# EAGLE design F3-Octo-Brushed-SIDE-USB-JMPR (EAGLE 7.5.0)
Title: F3 Octo Brushed - Side USB Author: Lance Source: Alienflight.com License: CC BY SA <http://creativecommons.org/licenses/by-sa/4.0/>
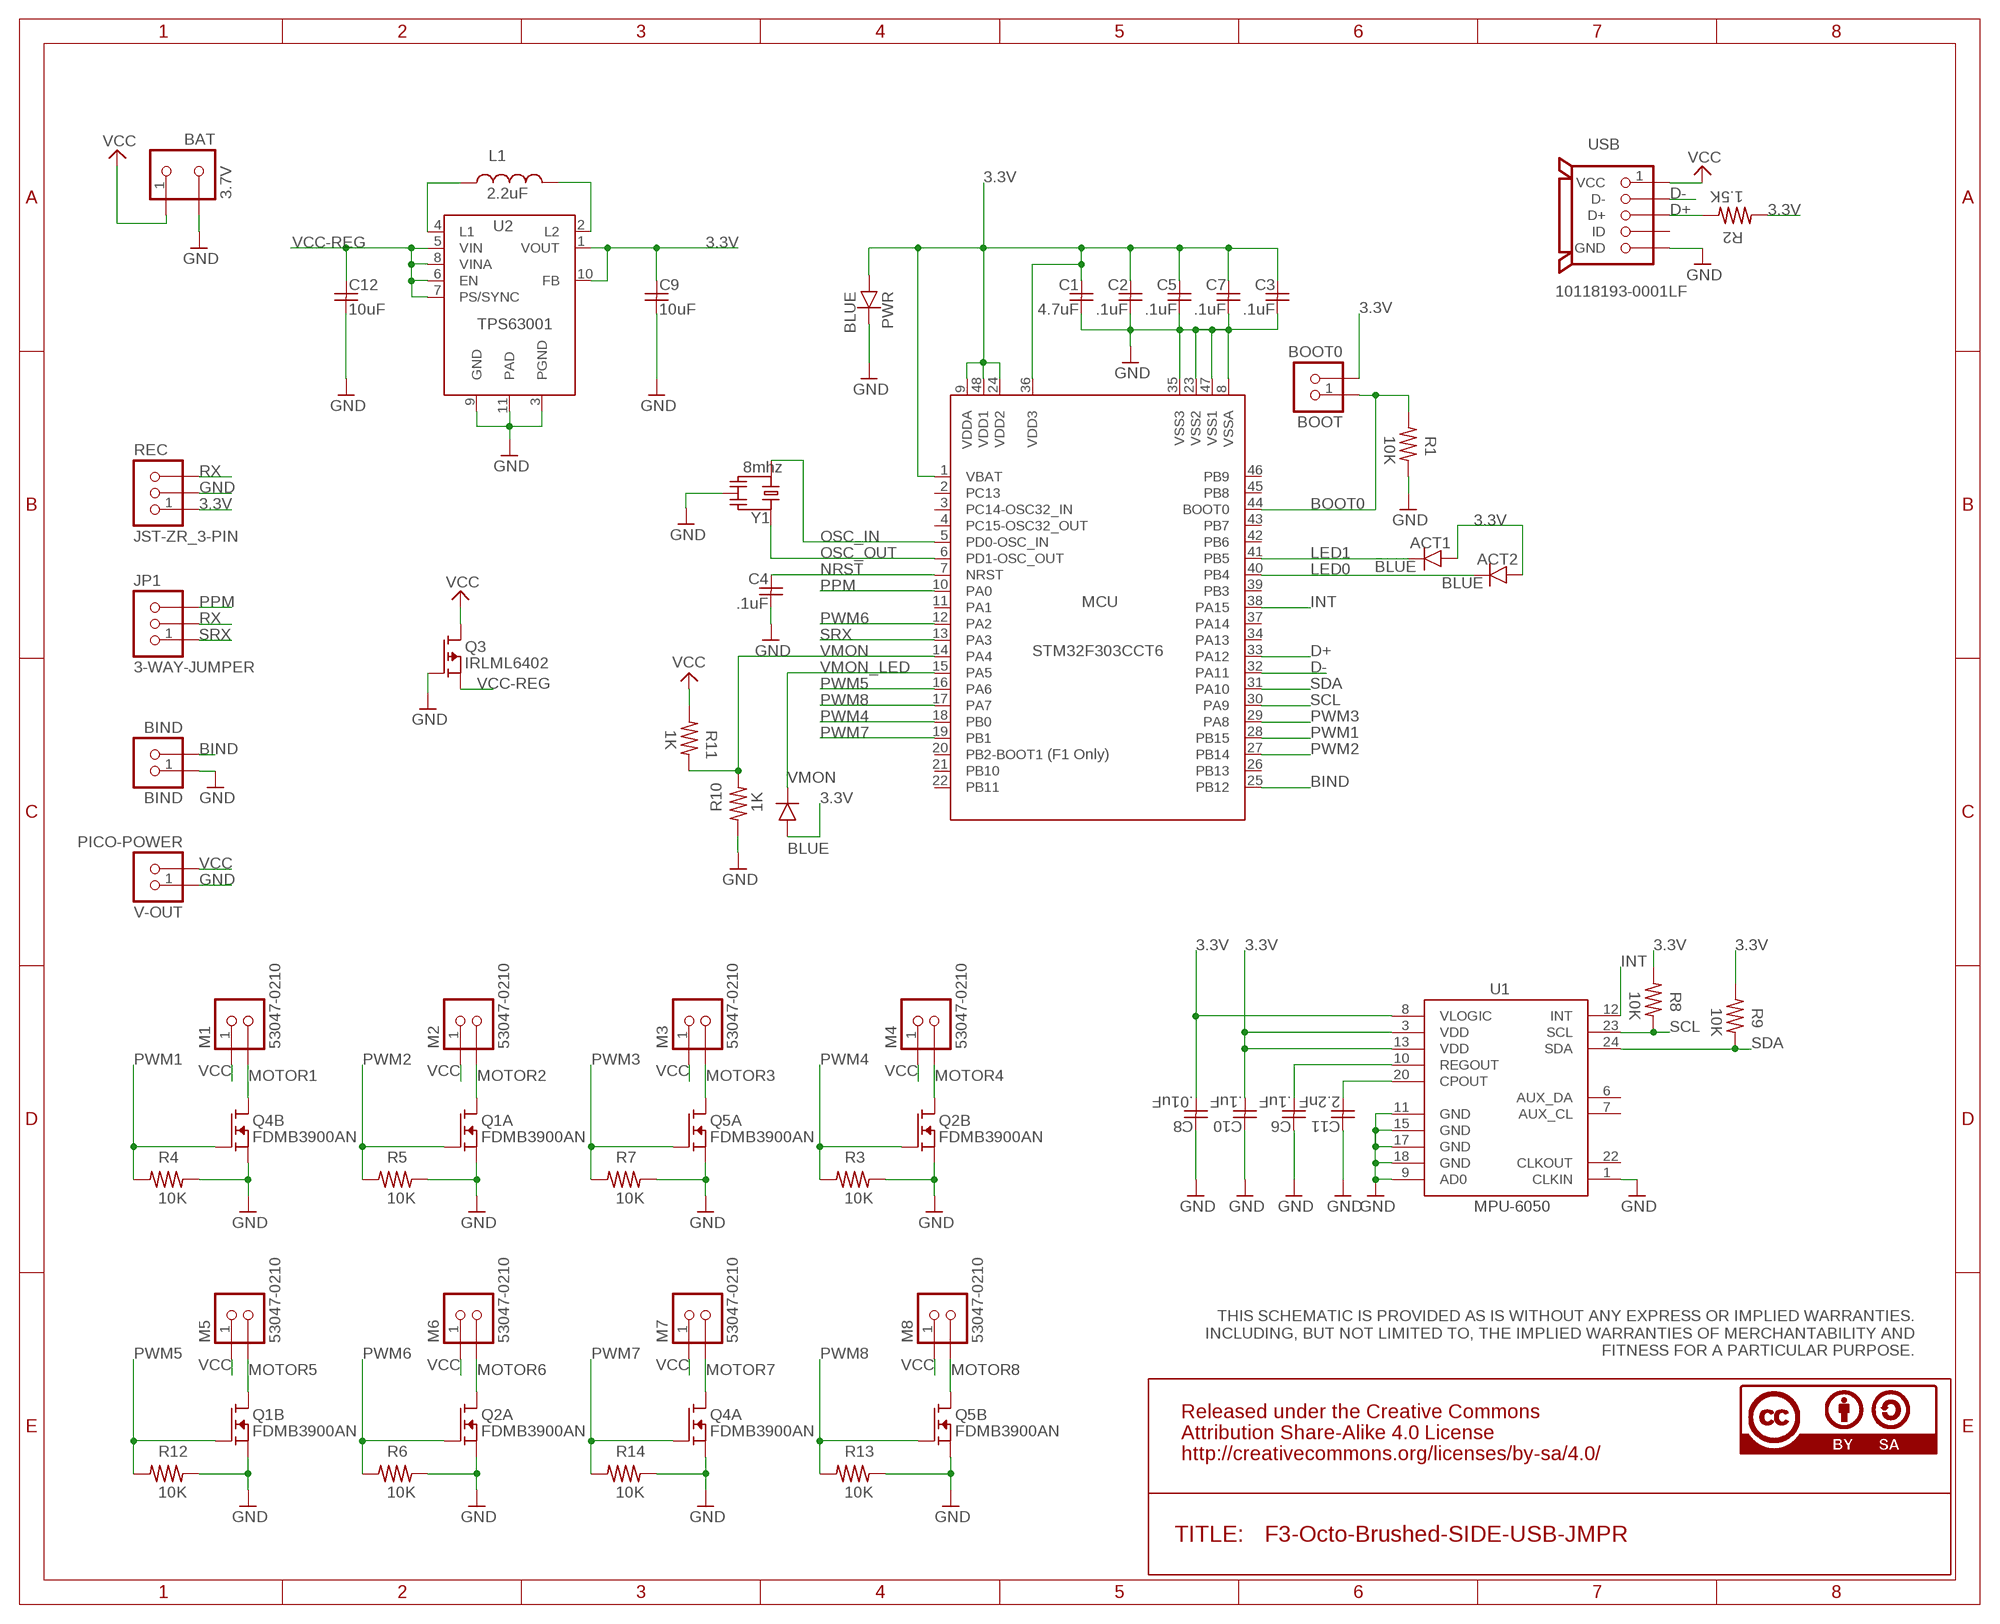
[diagram p0: schematic, sheet 1]

## Parts
ACT1  BLUE  SMD-CHIP-LED-0805  [SMD-CHIP-LED-0805]
ACT2  BLUE  SMD-CHIP-LED-0805  [SMD-CHIP-LED-0805]
BAT  3.7V  JST-PH-BAT  [S2B-PH-K-S]
BIND  BIND  1.27MM-PINHEADX2  [1.27MM-PINHEADX2]
BOOT  BOOT0  1.27MM-PINHEADX2  [1.27MM-PINHEADX2]
C1  4.7uF  CAPACITOR4.7UF  [MUR-CAP-0603]
C2  .1uF  CAPACITOR.1UF  [MUR-CAP-0603]
C3  .1uF  CAPACITOR.1UF  [MUR-CAP-0603]
C4  .1uF  CAPACITOR.1UF  [MUR-CAP-0603]
C5  .1uF  CAPACITOR.1UF  [MUR-CAP-0603]
C6  .1uF  CAPACITOR.1UF  [MUR-CAP-0603]
C7  .1uF  CAPACITOR.1UF  [MUR-CAP-0603]
C8  .01uF  CAPACITOR.01UF  [MUR-CAP-0603]
C9  10uF  CAPACITOR10UF  [YUDEN-CAP-0805]
C10  .1uF  CAPACITOR.1UF  [MUR-CAP-0603]
C11  2.2nF  CAPACITOR2.2NF  [MUR-CAP-0603]
C12  10uF  CAPACITOR10UF  [YUDEN-CAP-0805]
JP1  3-WAY-JUMPER  [3-WAY-JUMPER]
L1  2.2uF  NR301X  [NR301X]
M1  53047-0210  PICO-1.25-MOTOR  [PICO-53047-02]
M2  53047-0210  PICO-1.25-MOTOR  [PICO-53047-02]
M3  53047-0210  PICO-1.25-MOTOR  [PICO-53047-02]
M4  53047-0210  PICO-1.25-MOTOR  [PICO-53047-02]
M5  53047-0210  PICO-1.25-MOTOR  [PICO-53047-02]
M6  53047-0210  PICO-1.25-MOTOR  [PICO-53047-02]
M7  53047-0210  PICO-1.25-MOTOR  [PICO-53047-02]
M8  53047-0210  PICO-1.25-MOTOR  [PICO-53047-02]
MCU  STM32F303CCT6  STM32FX03-F3  [LQFP48-7X7]
PWR  BLUE  SMD-CHIP-LED-0805  [SMD-CHIP-LED-0805]
Q1  FDMB3900AN  [8-WDFN-DUAL]
Q2  FDMB3900AN  [8-WDFN-DUAL]
Q3  IRLML6402  [SOT-23]
Q4  FDMB3900AN  [8-WDFN-DUAL]
Q5  FDMB3900AN  [8-WDFN-DUAL]
R1  10K  RESISTOR10K  [VISH-RES-0603]
R2  1.5K  RESISTOR1.5K  [VISH-RES-0603]
R3  10K  RESISTOR10K  [VISH-RES-0603]
R4  10K  RESISTOR10K  [VISH-RES-0603]
R5  10K  RESISTOR10K  [VISH-RES-0603]
R6  10K  RESISTOR10K  [VISH-RES-0603]
R7  10K  RESISTOR10K  [VISH-RES-0603]
R8  10K  RESISTOR10K  [VISH-RES-0603]
R9  10K  RESISTOR10K  [VISH-RES-0603]
R10  1K  RESISTOR1K  [VISH-RES-0603]
R11  1K  RESISTOR1K  [VISH-RES-0603]
R12  10K  RESISTOR10K  [VISH-RES-0603]
R13  10K  RESISTOR10K  [VISH-RES-0603]
R14  10K  RESISTOR10K  [VISH-RES-0603]
REC  JST-ZR_3-PIN  [S3B-ZR]
U1  MPU-6050  [QFN24-4X4]
U2  TPS63001  TPS630XX-TPS63001  [VSON-N10]
USB  10118193-0001LF  USB-MICRO-B-FCI  [10118193-0001LF]
V-OUT  PICO-POWER  [PICO_1.25_.5MM]
VMON  BLUE  SMD-CHIP-LED-0805  [SMD-CHIP-LED-0805]
Y1  8mhz  RESONATOR8MHZ  [RESONATOR_8]

## Nets
3.3V: ACT1.A ACT2.A BOOT.2 C1.1 C2.1 C3.1 C5.1 C7.1 C8.2 C9.1 C10.2 MCU.1(VBAT) MCU.9(VDDA) MCU.24(VDD2) MCU.36(VDD3) MCU.48(VDD1) PWR.A R2.2 R8.2 R9.2 REC.1 U1.3(VDD) U1.8(VLOGIC) U1.13(VDD) U2.1(VOUT) U2.10(FB) VMON.A
BIND: BIND.2 MCU.25(PB12)
BOOT0: BOOT.1 MCU.44(BOOT0) R1.2
D+: MCU.33(PA12) R2.1 USB.3(D+)
D-: MCU.32(PA11) USB.2(D-)
GND: BAT.2 BIND.1 C1.2 C2.2 C3.2 C4.2 C5.2 C6.1 C7.2 C8.1 C9.2 C10.1 C11.1 C12.2 MCU.8(VSSA) MCU.23(VSS2) MCU.35(VSS3) MCU.47(VSS1) PWR.C Q1.1@S1(A:S) Q1.3@S1(B:S) Q2.1@S1(A:S) Q2.3@S1(B:S) Q3.1(G) Q4.1@S1(A:S) Q4.3@S1(B:S) Q5.1@S1(A:S) Q5.3@S1(B:S) R1.1 R3.1 R4.1 R5.1 R6.1 R7.1 R10.2 R12.1 R13.1 R14.1 REC.2 U1.1(CLKIN) U1.9(AD0) U1.11(GND) U1.15(GND) U1.17(GND) U1.18(GND) U2.3(PGND) U2.9(GND) U2.11(PAD) USB.5(GND) USB.GND USB.GND2(GND) USB.HOLE1(GND) USB.HOLE2(GND) V-OUT.1 Y1.2
INT: MCU.38(PA15) U1.12(INT)
LED0: ACT2.C MCU.40(PB4)
LED1: ACT1.C MCU.41(PB5)
MOTOR1: M1.2 Q4.5+6(B:D)
MOTOR2: M2.2 Q1.7+8(A:D)
MOTOR3: M3.2 Q5.7+8(A:D)
MOTOR4: M4.2 Q2.5+6(B:D)
MOTOR5: M5.2 Q1.5+6(B:D)
MOTOR6: M6.2 Q2.7+8(A:D)
MOTOR7: M7.2 Q4.7+8(A:D)
MOTOR8: M8.2 Q5.5+6(B:D)
N$1: C6.2 U1.10(REGOUT)
N$7: C11.2 U1.20(CPOUT)
N$8: L1.2 U2.2(L2)
N$9: L1.1 U2.4(L1)
NRST: C4.1 MCU.7(NRST)
OSC_IN: MCU.5(PD0-OSC_IN) Y1.3
OSC_OUT: MCU.6(PD1-OSC_OUT) Y1.1
PPM: JP1.3 MCU.10(PA0)
PWM1: MCU.28(PB15) Q4.4@G2(B:G) R4.2
PWM2: MCU.27(PB14) Q1.2@G1(A:G) R5.2
PWM3: MCU.29(PA8) Q5.2@G1(A:G) R7.2
PWM4: MCU.18(PB0) Q2.4@G2(B:G) R3.2
PWM5: MCU.16(PA6) Q1.4@G2(B:G) R12.2
PWM6: MCU.12(PA2) Q2.2@G1(A:G) R6.2
PWM7: MCU.19(PB1) Q4.2@G1(A:G) R14.2
PWM8: MCU.17(PA7) Q5.4@G2(B:G) R13.2
RX: JP1.2 REC.3
SCL: MCU.30(PA9) R8.1 U1.23(SCL)
SDA: MCU.31(PA10) R9.1 U1.24(SDA)
SRX: JP1.1 MCU.13(PA3)
VCC [vcc]: BAT.1 M1.1 M2.1 M3.1 M4.1 M5.1 M6.1 M7.1 M8.1 Q3.3(D) R11.2 USB.1(VCC) V-OUT.2
VCC-REG [vcc]: C12.1 Q3.2(S) U2.5(VIN) U2.6(EN) U2.7(PS/SYNC) U2.8(VINA)
VMON: MCU.14(PA4) R10.1 R11.1
VMON_LED: MCU.15(PA5) VMON.C
Unconnected: MCU.2(PC13) MCU.3(PC14-OSC32_IN) MCU.4(PC15-OSC32_OUT) MCU.11(PA1) MCU.20(PB2-BOOT1) MCU.21(PB10) MCU.22(PB11) MCU.26(PB13) MCU.34(PA13) MCU.37(PA14) MCU.39(PB3) MCU.42(PB6) MCU.43(PB7) MCU.45(PB8) MCU.46(PB9) U1.6(AUX_DA) U1.7(AUX_CL) U1.22(CLKOUT) USB.4(ID)

## Notes on the sheet
- THIS SCHEMATIC IS PROVIDED AS IS WITHOUT ANY EXPRESS OR IMPLIED WARRANTIES.
   INCLUDING, BUT NOT LIMITED TO, THE IMPLIED WARRANTIES OF MERCHANTABILITY AND
   FITNESS FOR A PARTICULAR PURPOSE.

## Library data of the parts
ACT1 ACT2 PWR VMON = Alienflight:SMD-CHIP-LED-0805: SMD CHIP LED APHCM2012QBC/D-F01 View Datasheet <https://www.kingbrightusa.com/images/catalog/spec/APHCM2012QBC-D-F01.pdf> Author: Lance Source: http://alienflight.com License: CC BY SA <creativecommons.org/licenses/by-sa/4.0/>; MF: Kingbright; MPN: APHCM2012QBC/D-F01
BAT = Alienflight:JST-PH-BAT: Battery Connector JST- S2B-PH-K-S View Datasheet <http://www.jst-mfg.com/product/pdf/eng/ePH.pdf> Author: Lance Source: http://alienflight.com License: CC BY SA <creativecommons.org/licenses/by-sa/4.0/>; MF: JST; MPN: S2B-PH-K-S
BIND BOOT = Alienflight:1.27MM-PINHEADX2: Jumper 1.27MM Pin Header X2 View Datasheet <http://www.sullinscorp.com/catalogs/82_PAGE90-91_.050_MALE_HDR_ST_RA_SMT.pdf> Author: Lance Source: http://alienflight.com License: CC BY SA <creativecommons.org/licenses/by-sa/4.0/>; MF: Sullins; MPN: GRPB021VWVN-RC (JUMPER IS M50-1930005)
C1 = Alienflight:CAPACITOR: CAPACITORS Murata Datasheet <http://www.murata.com/~/media/webrenewal/support/library/catalog/products/capacitor/mlcc/c02e.ashx?la=en-us> Taiyo Yuden Datasheet <http://www.mouser.com/ds/2/396/mlcc11_hq_e-541564.pdf> Author: Lance Source: http://alienflight.com License: CC BY SA <creativecommons.org/licenses/by-sa/4.0/>; MF: Murata; MPN: GRJ188C70J475KE11D
C2-C7 C10 = Alienflight:CAPACITOR: CAPACITORS Murata Datasheet <http://www.murata.com/~/media/webrenewal/support/library/catalog/products/capacitor/mlcc/c02e.ashx?la=en-us> Taiyo Yuden Datasheet <http://www.mouser.com/ds/2/396/mlcc11_hq_e-541564.pdf> Author: Lance Source: http://alienflight.com License: CC BY SA <creativecommons.org/licenses/by-sa/4.0/>; MF: Murata; MPN: GRM188R71C104KA01D
C8 = Alienflight:CAPACITOR: CAPACITORS Murata Datasheet <http://www.murata.com/~/media/webrenewal/support/library/catalog/products/capacitor/mlcc/c02e.ashx?la=en-us> Taiyo Yuden Datasheet <http://www.mouser.com/ds/2/396/mlcc11_hq_e-541564.pdf> Author: Lance Source: http://alienflight.com License: CC BY SA <creativecommons.org/licenses/by-sa/4.0/>; MF: Murata; MPN: GRM188R71C103KA01D
C9 C12 = Alienflight:CAPACITOR: CAPACITORS Murata Datasheet <http://www.murata.com/~/media/webrenewal/support/library/catalog/products/capacitor/mlcc/c02e.ashx?la=en-us> Taiyo Yuden Datasheet <http://www.mouser.com/ds/2/396/mlcc11_hq_e-541564.pdf> Author: Lance Source: http://alienflight.com License: CC BY SA <creativecommons.org/licenses/by-sa/4.0/>; MF: Taiyo Yuden; MPN: JMK212AB7106KG-T
C11 = Alienflight:CAPACITOR: CAPACITORS Murata Datasheet <http://www.murata.com/~/media/webrenewal/support/library/catalog/products/capacitor/mlcc/c02e.ashx?la=en-us> Taiyo Yuden Datasheet <http://www.mouser.com/ds/2/396/mlcc11_hq_e-541564.pdf> Author: Lance Source: http://alienflight.com License: CC BY SA <creativecommons.org/licenses/by-sa/4.0/>; MF: Murata; MPN: GRM188R71C222KA01D
JP1 = Alienflight:3-WAY-JUMPER: 3 Way Jumper
L1 = Alienflight:NR301X: 3X3mm Inductor NR3015T2R2M - Datasheet <http://datasheet.octopart.com/NR3015T2R2M-Taiyo-Yuden-datasheet-41181804.pdf> Author: Lance Source: http://alienflight.com License: CC BY SA <creativecommons.org/licenses/by-sa/4.0/>; MF: Taiyo Yuden; MPN: NR3015T2R2M
M1-M8 = Alienflight:PICO-1.25-MOTOR: Motor Connector PicoBlade 1.25 53047-02 View Datasheet <http://www.molex.com/webdocs/datasheets/pdf/en-us/0530470210_PCB_HEADERS.pdf> Author: Lance Source: http://alienflight.com License: CC BY SA <creativecommons.org/licenses/by-sa/4.0/>; MF: MOLEX; MPN: 53047-0210
MCU = Alienflight:STM32FX03: STM32F32FX03 Datasheet <http://www.st.com/web/en/resource/technical/document/datasheet/DM00058181.pdf> Author: Lance Source: http://alienflight.com License: CC BY SA <creativecommons.org/licenses/by-sa/4.0/>; MF: ST; MPN: STM32F303CCT6
Q1 Q2 Q4 Q5 = Alienflight:FDMB3900AN: Dual N-Channel MOSFET FDMB3900AN Datasheet <https://www.fairchildsemi.com/datasheets/FD/FDMB3900AN.pdf> Author: Lance Source:Alienflight.com License: CC BY SA <creativecommons.org/licenses/by-sa/4.0/>; MF: Fairchild; MPN: FDMB3900AN
Q3 = Alienflight:IRLML6402: P-Channel MOSFET IRLML6402 - Datasheet <http://www.irf.com/product-info/datasheets/data/irlml6402.pdf> Author: Lance Source: http://alienflight.com License: CC BY SA <creativecommons.org/licenses/by-sa/4.0/>; MF: IR; MPN: IRLML6402
R1 R3-R9 R12-R14 = Alienflight:RESISTOR: RESISTORS Vishay DataSheet <http://www.vishay.com/docs/20043/crcwhpe3.pdf> Author: Lance Source: http://alienflight.com License: CC BY SA <creativecommons.org/licenses/by-sa/4.0/>; MF: Vishay; MPN: CRCW060310K0FKEAHP
R2 = Alienflight:RESISTOR: RESISTORS Vishay DataSheet <http://www.vishay.com/docs/20043/crcwhpe3.pdf> Author: Lance Source: http://alienflight.com License: CC BY SA <creativecommons.org/licenses/by-sa/4.0/>; MF: Vishay; MPN: CRCW06031K50FKEAHP
R10 R11 = Alienflight:RESISTOR: RESISTORS Vishay DataSheet <http://www.vishay.com/docs/20043/crcwhpe3.pdf> Author: Lance Source: http://alienflight.com License: CC BY SA <creativecommons.org/licenses/by-sa/4.0/>; MF: Vishay; MPN: CRCW06031K00FKEAHP
REC = Alienflight:JST-ZR_3-PIN: 3 Pin Receiver JST - S3B-ZR View Datasheet <http://www.jst-mfg.com/product/pdf/eng/eZH.pdf> Author: Lance Source: http://alienflight.com License: CC BY SA <creativecommons.org/licenses/by-sa/4.0/>; MF: JST; MPN: S3B-ZR
U1 = Alienflight:MPU-6050: MPU-6050 View Datasheet <http://43zrtwysvxb2gf29r5o0athu.wpengine.netdna-cdn.com/wp-content/uploads/2015/02/MPU-6000-Datasheet1.pdf> Author: Lance Source: http://alienflight.com License: CC BY SA <creativecommons.org/licenses/by-sa/4.0/>; MF: Invensense; MPN: MPU-6050
U2 = Alienflight:TPS630XX: Buck/Boost Converter TPS63001/2 Datasheet <http://www.ti.com/lit/ds/symlink/tps63001.pdf> Author: Lance Source: http://alienflight.com License: CC BY SA <creativecommons.org/licenses/by-sa/4.0/>; MF: TI; MPN: TPS63001DRCR
USB = Alienflight:USB-MICRO-B: Micro-B USB Connector Author: Lance Source: http://alienflight.com License: CC BY SA <creativecommons.org/licenses/by-sa/4.0/>; MF: FCI; MPN: 10118193-0001LF
V-OUT = Alienflight:PICO-POWER: Pico Power Connector Picoblade 53047-0210 View Datasheet <http://www.molex.com/webdocs/datasheets/pdf/en-us/0530470210_PCB_HEADERS.pdf> Author: Lance Source: http://alienflight.com License: CC BY SA <creativecommons.org/licenses/by-sa/4.0/>; MF: Molex; MPN: 53047-0210
Y1 = Alienflight:RESONATOR: SMD Ceramic Resonators Ceralock Murata Datasheet <http://www.murata.com/~/media/webrenewal/support/library/catalog/products/timingdevice/ceralock/p16e.ashx> Author: Lance Source: http://alienflight.com License: CC BY SA <creativecommons.org/licenses/by-sa/4.0/>; MF: Murata; MPN: CSTCE8M00G55-R0

## Net classes
0 default: width 0.254 mm, drill 0.33 mm, clearance 0.178 mm
1 vcc: width 0.254 mm, drill 0.33 mm, clearance 0.178 mm

## Board
Title: F3 Octo Brushed - Side USB Author: Lance Source: Alienflight.com License: CC BY SA <http://creativecommons.org/licenses/by-sa/4.0/>
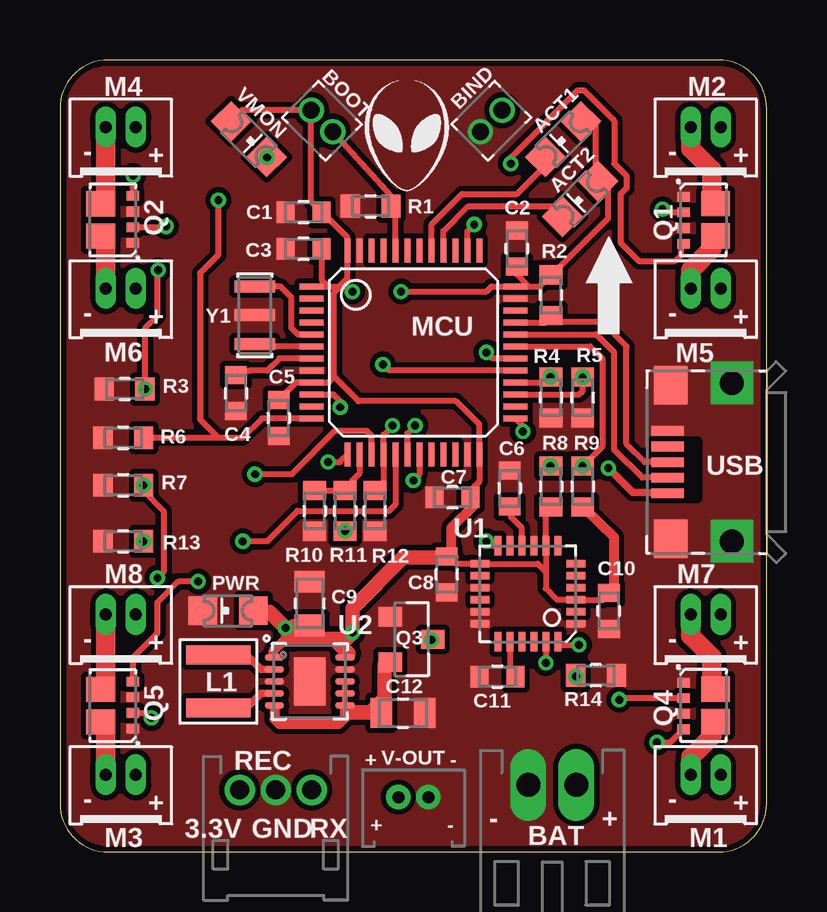
[diagram p1: board, top side]
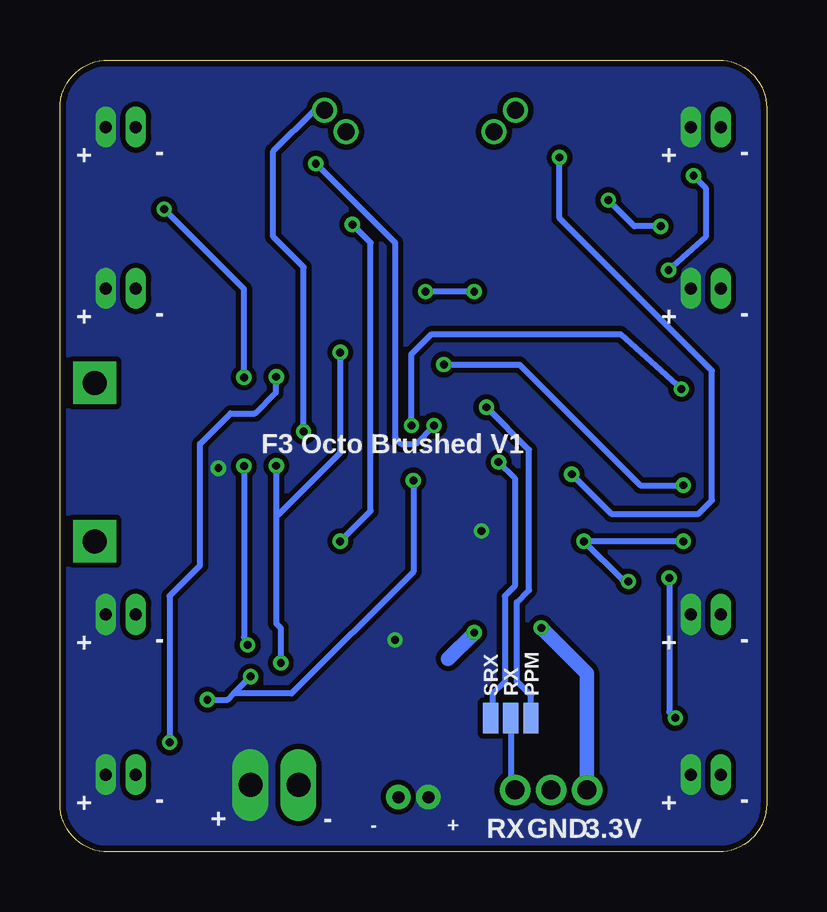
[diagram p2: board, bottom side, seen from below]

Size 29.46 x 33.02 mm. Coordinates in mm from the lower left corner, seen from the top.
Outline: 0,31.02 0,2 arc90 2,0 27.46,0 arc90 29.46,2 29.46,31.02 arc90 27.46,33.02 2,33.02 arc90 0,31.02
Copper layers (1*16): Top 0.035mm / dielectric 1.5mm / Bottom 0.035mm
Design rules "Alien-Design-Rules": minimum track width 6mil, minimum drill 12mil, track to track 6mil, track to pad 6mil, pad to pad 6mil, via to via 6mil, smd to smd 0mil, copper to edge 10mil, drill to drill 10mil, minimum pad ring 7mil, minimum via ring 6mil, stop-mask expansion 0mil, vias tented up to drill 20mil, thermal gap 10mil

### Footprints (pad centres in the part's own frame; a part is rotated, then mirrored left to right if it is on the bottom)
SMD-CHIP-LED-0805 = smd 1.2 x 1.2: A -1.05,0; C 1.05,0
S2B-PH-K-S = drill 1 long: 1 1,0; 2 -1,0
1.27MM-PINHEADX2 = drill 0.7: 1 -0.635,0; 2 0.635,0
MUR-CAP-0603 = smd 0.75 x 0.9: 1 -0.75,0; 2 0.75,0
YUDEN-CAP-0805 = smd 0.9 x 1.25: 1 -0.9,0; 2 0.9,0
3-WAY-JUMPER = smd 0.635 x 1.27: 1 -0.84,0; 2 0,0; 3 0.84,0
NR301X = smd 2.7 x 0.8: 1 0,1.1; 2 0,-1.1
PICO-53047-02 = drill 0.5 pad 0.813 long: 1 0.625,0; 2 -0.625,0
LQFP48-7X7 = smd 0.254 x 1: 1 -2.75,-4.25; 2 -2.25,-4.25; 3 -1.75,-4.25; 4 -1.25,-4.25; 5 -0.75,-4.25; 6 -0.25,-4.25; 7 0.25,-4.25; 8 0.75,-4.25; 9 1.25,-4.25; 10 1.75,-4.25; 11 2.25,-4.25; 12 2.75,-4.25; 25 2.75,4.25; 26 2.25,4.25; 27 1.75,4.25; 28 1.25,4.25; 29 0.75,4.25; 30 0.25,4.25; 31 -0.25,4.25; 32 -0.75,4.25; 33 -1.25,4.25; 34 -1.75,4.25; 35 -2.25,4.25; 36 -2.75,4.25 | smd 1 x 0.254: 13 4.25,-2.75; 14 4.25,-2.25; 15 4.25,-1.75; 16 4.25,-1.25; 17 4.25,-0.75; 18 4.25,-0.25; 19 4.25,0.25; 20 4.25,0.75; 21 4.25,1.25; 22 4.25,1.75; 23 4.25,2.25; 24 4.25,2.75; 37 -4.25,2.75; 38 -4.25,2.25; 39 -4.25,1.75; 40 -4.25,1.25; 41 -4.25,0.75; 42 -4.25,0.25; 43 -4.25,-0.25; 44 -4.25,-0.75; 45 -4.25,-1.25; 46 -4.25,-1.75; 47 -4.25,-2.25; 48 -4.25,-2.75
8-WDFN-DUAL = smd 0.4 x 0.52: 1@S1 0.2,0.26; 2@G1 0.85,0.26; 3@S1 1.5,0.26; 4@G2 2.15,0.26 | smd 1.05 x 1.2: 5+6 1.825,1.6; 7+8 0.475,1.6
SOT-23 = smd 0.802 x 0.972: 1 -0.95,-0.885; 2 0.95,-0.885; 3 0,0.885
VISH-RES-0603 = smd 0.8 x 0.95: 1 -0.85,0; 2 0.85,0
S3B-ZR = drill 0.8 pad 1.27: 1 -1.5,0; 2 0,0; 3 1.5,0
QFN24-4X4 = smd 0.8 x 0.3: 1 -2,1.25; 2 -2,0.75; 3 -2,0.25; 4 -2,-0.25; 5 -2,-0.75; 6 -2,-1.25; 13 2,-1.25; 14 2,-0.75; 15 2,-0.25; 16 2,0.25; 17 2,0.75; 18 2,1.25 | smd 0.3 x 0.8: 7 -1.25,-2; 8 -0.75,-2; 9 -0.25,-2; 10 0.25,-2; 11 0.75,-2; 12 1.25,-2; 19 1.25,2; 20 0.75,2; 21 0.25,2; 22 -0.25,2; 23 -0.75,2; 24 -1.25,2
VSON-N10 = smd 0.8 x 0.26: 1 -1.475,1; 2 -1.475,0.5; 3 -1.475,0; 4 -1.475,-0.5; 5 -1.475,-1; 6 1.475,-1; 7 1.475,-0.5; 8 1.475,0; 9 1.475,0.5; 10 1.475,1 | smd 1.3 x 2: 11 0,0
10118193-0001LF = smd 0.4 x 1.35: 1 1.3,-4.125; 2 0.65,-4.125; 3 0,-4.125; 4 -0.65,-4.125; 5 -1.3,-4.125 | smd 1.6 x 1.4: GND -3.2,-4; GND2 3.2,-4 | drill 1 pad 1.778 square: HOLE1 -3.3,-1.45; HOLE2 3.3,-1.45
PICO_1.25_.5MM = drill 0.5 pad 1.016: 1 0.625,0; 2 -0.625,0
RESONATOR_8 = smd 0.5 x 1.7: 1 -1.2,0; 2 0,0; 3 1.2,0

### Placement (x,y rotation side)
ACT1  20.98,29.72 225 top
ACT2  21.69,27.23 225 top
BAT  20.52,2.79 0 top
BIND  17.98,30.48 45 top
BOOT  10.92,30.48 135 top
C1  10.16,26.67 180 top
C2  19.05,25.16 90 top
C3  10.16,25.15 180 top
C4  7.34,19.13 270 top
C5  9.12,18.08 270 top
C6  18.75,15.16 270 top
C7  16.36,14.78 180 top
C8  16.13,11.58 90 top
C9  10.41,10.36 90 top
C10  22.89,10.06 90 top
C11  18.24,7.32 0 top
C12  14.3,5.79 0 top
JP1  10.67,5.59 0 bottom
L1  6.6,7.11 180 top
M1  26.92,3.23 0 top
M2  26.92,30.23 0 top
M3  2.54,3.23 0 top
M4  2.54,30.23 0 top
M5  26.92,23.5 0 top
M6  2.54,23.5 0 top
M7  26.92,9.91 0 top
M8  2.54,9.91 0 top
MCU  14.73,20.83 270 top
PWR  7.01,10.06 180 top
Q1  25.73,27.51 270 top
Q2  3.3,25.2 90 top
Q3  14.66,8.86 270 top
Q4  25.73,7.26 270 top
Q5  3.3,4.95 90 top
R1  12.95,26.92 0 top
R2  20.47,23.22 90 top
R3  2.69,19.3 0 top
R4  20.47,18.95 90 top
R5  21.79,18.95 90 top
R6  2.64,17.27 0 top
R7  2.64,15.29 0 top
R8  20.47,15.24 270 top
R9  21.79,15.24 270 top
R10  10.62,14.22 270 top
R11  11.89,14.22 270 top
R12  13.13,14.22 90 top
R13  2.64,12.95 0 top
R14  22.35,7.37 180 top
REC  8.99,2.59 0 top
U1  19.51,10.77 180 top
U2  10.41,7.11 0 top
U$1  [ALIENHEADSMALL]  14.48,30.23 0 top
U$2  [ARROW]  22.86,23.11 0 top
USB  29.46,16.26 270 top
V-OUT  14.73,2.29 0 top
VMON  7.87,29.72 315 top
Y1  8.13,22.38 90 top

### Tracks (layer width: path | path; a pad name or v marks a point on that pad's centre or on a via)
3.3V  (via drill 0.33)
  Top 0.254: 16.33,12.27 16.26,12.2 | U2.1 8.91,8.2 | 11.86,8.16 U2.10 11.89,8.59 11.68,8.89 | C8.2 16.52,12.02 U1.13 19.92,12.02 20.26,11.68 | 23.04,10.78 C10.2 22.65,10.52 U1.3 20.73,10.52 20.26,10.98 20.26,11.68 | 20.26,11.68 U1.8 20.26,14.07 R8.2 | C5.1 9.84,19.58 MCU.9 11.2,19.58 11.43,19.81 | 11.43,19.81 11.43,23.32 11.68,23.58 | MCU.1 11.18,23.58 | 11.18,23.58 11.64,23.58 | 11.64,23.58 11.98,23.92 MCU.48 11.98,25.61 11.18,26.42 10.99,26.42 C1.1 10.67,26.91 10.67,26.92 10.47,27.12 BOOT.2 7.6,30.93 VMON.A | 11.64,23.58 11.68,23.58 | 11.43,19.81 12.45,18.8 16.51,18.8 17.48,17.82 MCU.24 17.48,15.45 17.27,15.24 17.27,14.97 C7.1 17.14,14.85 17.27,14.85 | 19.56,23.58 MCU.36 17.99,23.58 17.78,23.37 v14.22,23.37 | 19.56,23.58 19.98,23.58 R2.2 20.51,24.07 22.86,26.42 22.86,27.69 22.48,28.07 | C2.1 19.05,24.09 19.56,23.58 | 22.48,28.07 22.35,28.19 22.35,30.48 22.32,30.51 ACT1.A | ACT2.A 22.48,28.04 22.48,28.07 | 11.68,23.58 11.98,23.58 v12.19,23.37 | C3.1 10.91,23.84 11.18,23.58
  Top 0.406: 8.91,8.2 8.91,8.41 9.4,8.89 v9.4,9.35 | 11.86,8.16 11.86,8.46 12.04,8.28 | C8.2 16.13,12.22 16.33,12.27 16.33,13.53 17.27,14.48 17.27,14.85 | C10.2 23.11,10.99 23.11,13.12 R9.2 | C9.1 9.97,9.65 9.72,9.41
  Top 0.61: 12.04,8.28 11.43,8.89 | 11.43,8.89 9.86,8.89 | 9.86,8.89 9.65,8.89 9.65,9.14 9.72,9.21 9.72,9.41 | 9.86,8.89 v9.4,9.35 8.74,10.01 PWR.A | 11.43,8.89 11.94,8.89 v12.19,9.14 12.19,10.16 14.31,12.27 16.33,12.27
  Bottom 0.254: v12.19,23.37 v14.22,23.37
  Bottom 0.61: v9.4,9.35 7.5,7.45 7.5,2.6 REC.1 | 13.28,8.05 v12.19,9.14
BIND  (via drill 0.33)
  Top 0.254: MCU.25 19.3,17.76 v19.3,17.53
  Bottom 0.254: v19.3,17.53 19.3,24.38 20.57,25.65 20.57,29.21 18.86,30.93 BIND.2
BOOT0
  Top 0.254: MCU.44 13.98,26.85 R1.2 13.82,27.09 13.82,27.33 BOOT.1
D+
  Top 0.254: USB.3 24.38,16.26 23.62,17.02 23.62,21.08 22.61,22.1 20.84,22.1 R2.1 20.29,22.08 MCU.33
D-
  Top 0.254: USB.2 24.27,15.61 23.11,16.76 23.11,20.83 22.36,21.58 MCU.32
GND
  pour Top (isolate 0.216, no thermals): 0.1,31.07 0.1,2.05 arc90 2.1,0.05 27.31,0.05 arc90 29.31,2.05 29.31,31.07 arc90 27.31,33.07 2.1,33.07 arc90
INT  (via drill 0.33)
  Top 0.254: U1.12 17.96,12.77 v17.78,12.95 | MCU.38 16.98,25.87 v17.27,26.16
  Bottom 0.254: v17.78,12.95 16.51,14.22 16.51,25.4 v17.27,26.16
LED0
  Top 0.254: MCU.40 15.98,25.89 17.02,26.92 20.83,26.92 ACT2.C
LED1
  Top 0.254: MCU.41 15.48,25.9 15.49,25.91 15.49,26.16 16.76,27.43 19.05,27.43 20.34,28.72 ACT1.C
MOTOR1
  Top 0.813: M1.2 26.3,3.95 27.18,4.83 27.18,5.39 Q4.5+6
MOTOR2
  Top 0.813: M2.2 26.3,29.33 27.18,28.45 27.18,27.03 Q1.7+8
MOTOR3
  Top 0.813: M3.2 1.92,5.51 Q5.7+8
MOTOR4
  Top 0.813: M4.2 1.92,27.01 Q2.5+6
MOTOR5
  Top 0.813: M5.2 26.3,24.27 27.18,25.15 27.18,25.53 Q1.5+6
MOTOR6
  Top 0.813: 1.92,24.01 M6.2 1.92,25.58 Q2.7+8
MOTOR7
  Top 0.813: M7.2 26.3,9.01 27.18,8.13 27.18,6.84 Q4.7+8
MOTOR8
  Top 0.813: M8.2 1.92,6.95 Q5.5+6
N$1
  Top 0.254: U1.10 19.26,13.51 18.8,13.97 18.8,14.36 C6.2
N$7
  Top 0.254: U1.20 18.76,7.59 C11.2
N$8
  Top 0.305: U2.2 8.39,7.61 7.87,8.13 6.7,8.13 L1.2
N$9
  Top 0.305: U2.4 8.39,6.61 7.87,6.1 6.69,6.1 L1.1
NRST
  Top 0.254: MCU.7 9.15,20.58 8.64,20.07 7.94,20.07 C4.1
OSC_IN
  Top 0.254: MCU.5 9.92,21.58 9.65,21.84 9.65,23.11 9.19,23.58 Y1.3
OSC_OUT
  Top 0.254: MCU.6 8.23,21.08 Y1.1
PPM  (via drill 0.33)
  Top 0.254: MCU.10 11.4,19.08 11.68,18.8 v11.68,18.54
  Bottom 0.254: v11.68,18.54 9.91,16.76 9.91,10.92 10.41,10.41 10.41,7.11 9.83,6.53 JP1.3
PWM1  (via drill 0.33)
  Top 0.254: v20.45,19.81 20.61,19.81 | MCU.28 20.09,19.58 v20.45,19.81 | v20.45,19.81 R4.2 | v24.89,4.57 25.45,4.57 Q4.4@G2
  Bottom 0.254: v20.45,19.81 20.47,19.79 20.47,19.15 21.34,18.29 22.35,18.29 23.62,17.02 23.62,11.94 24.89,10.67 v24.89,4.57
PWM2  (via drill 0.33)
  Top 0.254: 21.79,19.89 R5.2 v21.79,19.79 21.79,19.23 21.64,19.08 MCU.27 | v25.12,26.8 25.27,26.8 25.4,26.67 25.98,26.67 Q1.2@G1
  Bottom 0.254: v21.79,19.79 21.79,23.47 v25.12,26.8
PWM3  (via drill 0.33)
  Top 0.254: R7.2 v3.48,15.29 3.48,15.06 4.32,14.22 4.32,11.68 v4.06,11.43 | MCU.29 13.73,20.08 v13.46,20.32 | Q5.2@G1 3.6,5.8 v3.81,5.59
  Bottom 0.254: v13.46,20.32 10.3,20.32 5.27,15.29 v3.48,15.29 | v4.06,11.43 4.06,5.84 v3.81,5.59
PWM4  (via drill 0.33)
  Top 0.254: R3.2 v3.56,19.3 3.56,21.84 4.06,22.35 4.06,24.23 v4.09,24.26 | MCU.18 14.48,17.45 v14.81,17.78 | Q2.4@G2 3.04,27.43 v3.05,28.19
  Bottom 0.254: v3.56,19.3 6.1,21.59 13.97,21.59 14.81,20.75 v14.81,17.78 | v3.05,28.19 2.54,27.69 2.54,25.65 v4.09,24.26
PWM5  (via drill 0.33)
  Top 0.254: R12.2 13.48,15.02 MCU.16 13.48,17.39 v13.87,17.78 | v18.8,28.7 18.8,28.96 21.59,31.75 21.84,31.75 23.11,30.48 23.11,28.7 23.62,28.19 23.62,27.69 23.37,27.43 23.37,25.4 24.13,24.64 25.65,24.64 25.91,24.89 25.91,25.28 Q1.4@G2
  Bottom 0.254: v18.8,28.7 15.49,25.4 15.49,17.27 15.24,17.02 14.63,17.02 v13.87,17.78
PWM6  (via drill 0.33)
  Top 0.254: R6.2 6.6,17.27 | 6.6,17.27 7.62,17.27 8.43,18.08 MCU.12 | 6.6,17.27 5.84,18.03 5.84,24.13 6.6,24.89 v6.6,27.18 | Q2.2@G1 4.38,26.05 v4.42,26.09
  Bottom 0.254: v4.42,26.09 5.51,26.09 v6.6,27.18
PWM7  (via drill 0.33)
  Top 0.254: R14.2 v21.51,7.32 | MCU.19 14.98,15.74 v14.73,15.49 | Q4.2@G1 23.38,6.41 v23.32,6.35
  Bottom 0.254: v14.73,15.49 14.73,11.68 19.81,6.6 22.23,6.6 | v23.32,6.35 22.48,6.35 22.23,6.6 | 22.23,6.6 v21.51,7.32
PWM8  (via drill 0.33)
  Top 0.254: v7.62,12.95 8.64,12.95 9.91,14.22 13.72,14.22 13.98,14.49 MCU.17 | v5.77,11.28 4.93,11.28 4.06,10.41 4.06,9.14 3.04,8.12 Q5.4@G2
  Top 0.305: v3.48,12.95 R13.2
  Bottom 0.254: v3.48,12.95 v7.62,12.95 6.02,11.35 5.77,11.35 v5.77,11.28
RX
  Bottom 0.254: JP1.2 10.67,2.77 REC.3
SCL  (via drill 0.33)
  Top 0.254: U1.23 v20.26,7.89 | MCU.30 18.03,20.58 v17.78,20.83
  Top 0.305: R8.1 20.62,16.2 v20.45,16.1
  Bottom 0.254: v17.78,20.83 17.78,16.64 20.45,13.97 | v20.45,16.1 20.45,13.97 | 20.45,13.97 20.45,9.53 20.26,9.34 v20.26,7.89
SDA  (via drill 0.33)
  Top 0.254: MCU.31 22.1,21.08 22.61,20.57 22.61,16.9 R9.1 | U1.24 20.89,8.64 v21.64,8.64
  Top 0.305: 21.99,15.94 R9.1 21.94,16.09 R9.1
  Bottom 0.254: R9.1 21.79,8.97 v21.64,8.64
  other vias: 21.79,16.09
SRX  (via drill 0.33)
  Top 0.254: v11.18,16.26 11.66,16.26 MCU.13
  Bottom 0.254: v11.18,16.26 10.51,15.59 10.51,11.09 10.92,10.67 10.92,7.11 11.43,6.6 11.43,5.16 JP1.1
VCC  (via drill 0.33)
  Top 0.254: v15.49,8.84 15.73,8.79 Q3.3 | R11.2 v11.89,13.39
  Top 0.305: USB.1 24.93,14.95 24.38,14.99 23.88,14.99 v22.86,16
  Bottom 0.254: v11.89,13.39 11.94,13.21
  pour Bottom (isolate 0.216, no thermals): 0.1,31.07 0.1,2.05 arc90 2.1,0.05 27.31,0.05 arc90 29.31,2.05 29.31,31.07 arc90 27.31,33.07 2.1,33.07 arc90
VCC-REG
  Top 0.254: U2.5 8.94,6 8.94,5.94 | U2.6 U2.7 U2.8
  Top 0.406: 11.89,5.59 11.63,5.33 9.14,5.33 8.94,5.54 8.94,6 | 11.89,5.59 U2.6 | 12.13,5.83 11.89,5.59
  Top 0.61: 12.13,5.83 12.95,5.83 | 12.95,5.83 13.27,5.83 13.4,5.95 C12.1 | 12.95,5.83 13.54,6.41 13.54,7.8 Q3.2
VMON
  Top 0.254: R10.1 R11.1 12.19,15.33 12.19,15.49 12.48,15.78 MCU.14
VMON_LED  (via drill 0.33)
  Top 0.254: VMON.C 8.66,28.68 v8.64,28.96 | MCU.15 12.98,17.37 12.8,17.55 11.46,17.55 9.65,15.75 v8.13,15.75
  Bottom 0.254: v8.13,15.75 6.48,14.1 2.85,14.1 2.29,14.66 2.29,20.07 8.64,26.42 v8.64,28.96

### Text on the board
tPlace: + | -
bPlace: PPM | RX | SRX
bNames: F3 Octo Brushed V1
Guide: Released under the Creative Commons Attribution Share-Alike 4.0 License / http://creativecommons.org/licenses/by-sa/4.0/ | THIS BOARD DESIGN IS PROVIDED AS IS WITHOUT ANY EXPRESS OR IMPLIED WARRANTIES. / INCLUDING, BUT NOT LIMITED TO, THE IMPLIED WARRANTIES OF MERCHANTABILITY AND / FITNESS FOR A PARTICULAR PURPOSE.